# EAGLE design ParticleTestv2 (EAGLE 9.2.2)
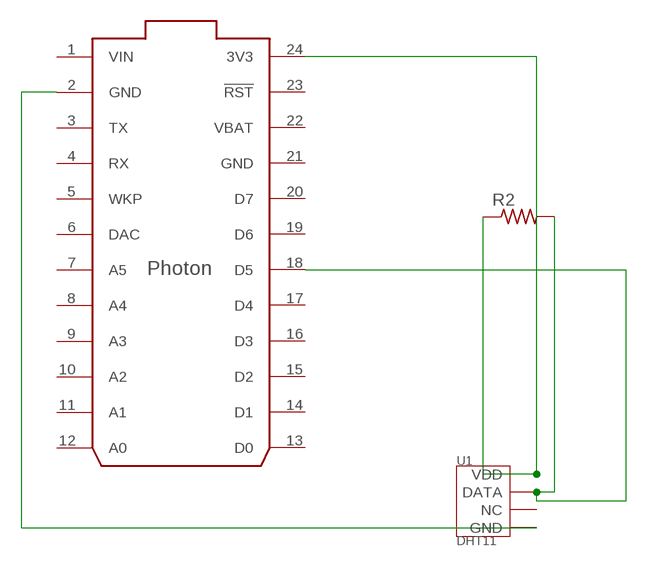
[diagram p0: schematic, sheet 1]

## Parts
R2  R-US_R0805  [R0805]
U1  DHT11  TEM-HUM-DHT11(4P-15.5X12.0MM)  [SNR4-2.54-15.5X12.0X5.5MM]
U$1  PHOTON_WITH_HEADERS  [PHOTON]

## Nets
GND: U1.4(GND) U$1.2(GND)
N$1: R2.2 U1.2(DATA) U$1.18(D5)
VDD: R2.1 U1.1(VDD) U$1.24(3V3)
Unconnected: U1.3(NC) U$1.3(TX) U$1.4(RX) U$1.5(WKP) U$1.6(DAC) U$1.7(A5) U$1.8(A4) U$1.9(A3) U$1.10(A2) U$1.11(A1) U$1.12(A0) U$1.13(D0) U$1.14(D1) U$1.15(D2) U$1.16(D3) U$1.17(D4) U$1.19(D6) U$1.20(D7) U$1.23(!RST)

## Power pins joined to a net without a drawn wire
GND: U$1.21(GND)
VBAT: U$1.22(VBAT)
VIN: U$1.1(VIN)

## Library data of the parts
R2 = adafruit:R-US_: RESISTOR, American symbol
U1 = Seeed-Sensor:TEM-HUM-DHT11(4P-15.5X12.0MM): 314010000; MPN: DHT11
U$1 = Particle-Devices:PHOTON: Particle Photon Wi-Fi through-hole development board footprint Product datasheet: here <https://docs.particle.io/datasheets/photon-(wifi)/photon-datasheet/> Design files: here <https://github.com/particle-iot/photon> Github : Particle devices library <https://github.com/particle-iot/hardware-libraries/tree/master/Eagle>

## Board
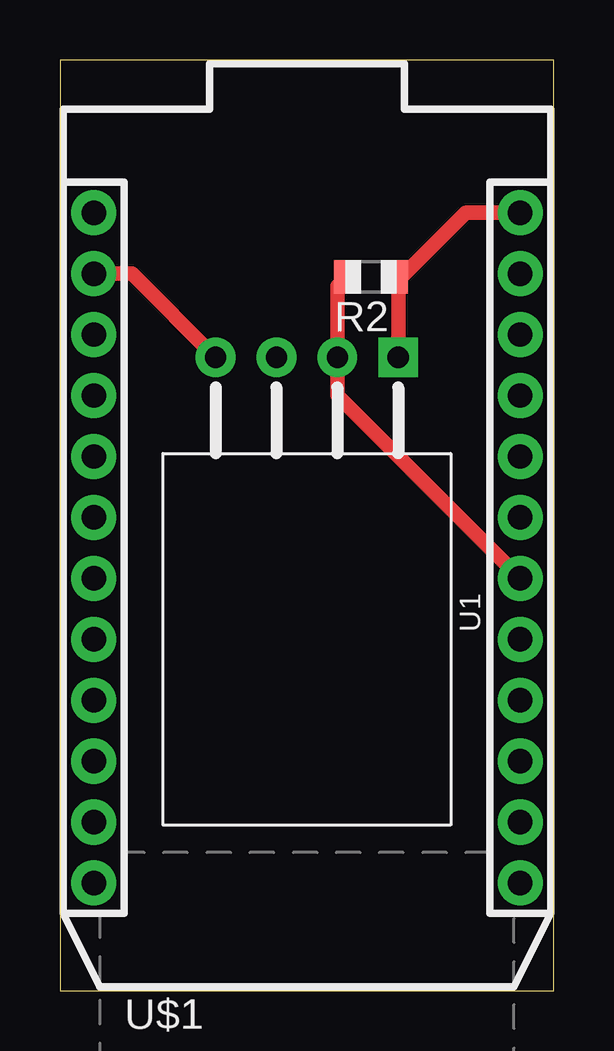
[diagram p1: board, top side]
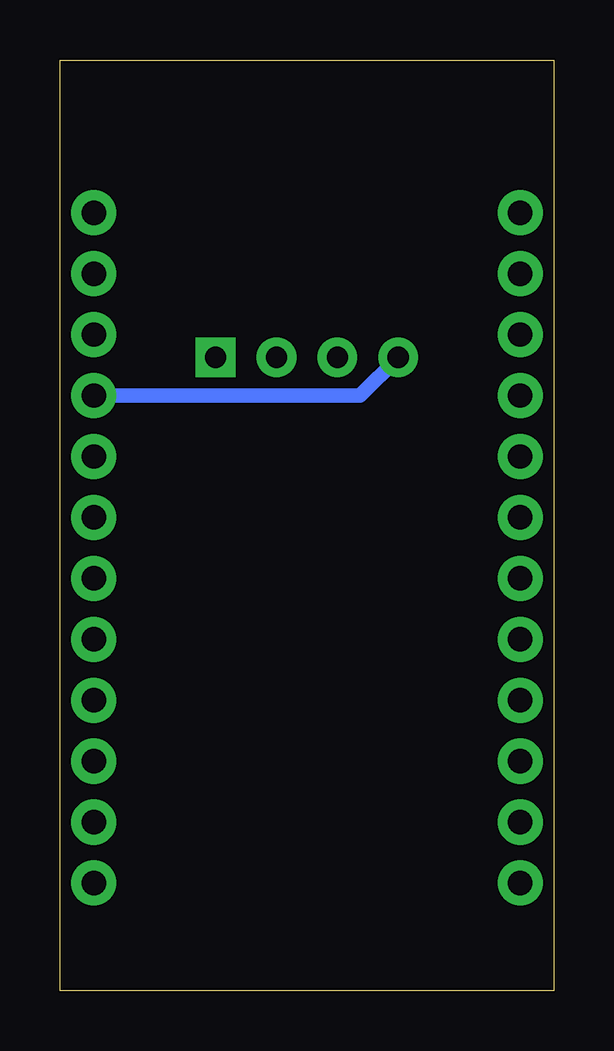
[diagram p2: board, bottom side, seen from below]

Size 20.6 x 38.8 mm. Coordinates in mm from the lower left corner, seen from the top.
Outline: 0,0 20.6,0 20.6,38.8 0,38.8 0,0
Copper layers (1*16): Top 0.035mm / dielectric 1.5mm / Bottom 0.035mm
Design rules "default *": minimum track width 16mil, minimum drill 0.35mm, track to track 6mil, track to pad 6mil, pad to pad 6mil, via to via 6mil, smd to smd 6mil, copper to edge 40mil, drill to drill 6mil, minimum pad ring 10mil, minimum via ring 8mil, stop-mask expansion 4mil, vias tented up to drill 0mil, thermal gap 10mil

### Footprints (pad centres in the part's own frame; a part is rotated, then mirrored left to right if it is on the bottom)
R0805 = smd 1.1 x 1.4: 1 -1,0; 2 1,0
SNR4-2.54-15.5X12.0X5.5MM = drill 0.889 pad 1.651 square: 1 -11.75,3.81 | drill 0.889 pad 1.651: 2 -11.75,1.27; 3 -11.75,-1.27; 4 -11.75,-3.81
PHOTON = drill 1.016 pad 1.88: 1 1.27,33.02; 2 1.27,30.48; 3 1.27,27.94; 4 1.27,25.4; 5 1.27,22.86; 6 1.27,20.32; 7 1.27,17.78; 8 1.27,15.24; 9 1.27,12.7; 10 1.27,10.16; 11 1.27,7.62; 12 1.27,5.08; 13 19.05,5.08; 14 19.05,7.62; 15 19.05,10.16; 16 19.05,12.7; 17 19.05,15.24; 18 19.05,17.78; 19 19.05,20.32; 20 19.05,22.86; 21 19.05,25.4; 22 19.05,27.94; 23 19.05,30.48; 24 19.05,33.02

### Placement (x,y rotation side)
R2  12.97,29.76 180 top
U1  10.3,14.65 270 top
U$1  0.14,-0.59 0 top

### Tracks (layer width: path | path; a pad name or v marks a point on that pad's centre or on a via)
GND
  Top 0.61: U$1.2 3,29.89 U1.4
  Bottom 0.61: U1.4 8.08,24.81 U$1.21
N$1
  Top 0.61: R2.2 11.57,29.37 U1.2 11.57,24.81 U$1.18
VDD
  Top 0.61: U1.1 14.11,29.62 | 14.11,29.62 R2.1 | U$1.24 16.92,32.43 14.11,29.62